# EAGLE design HTVC_connector_board (EAGLE 7.4.0)
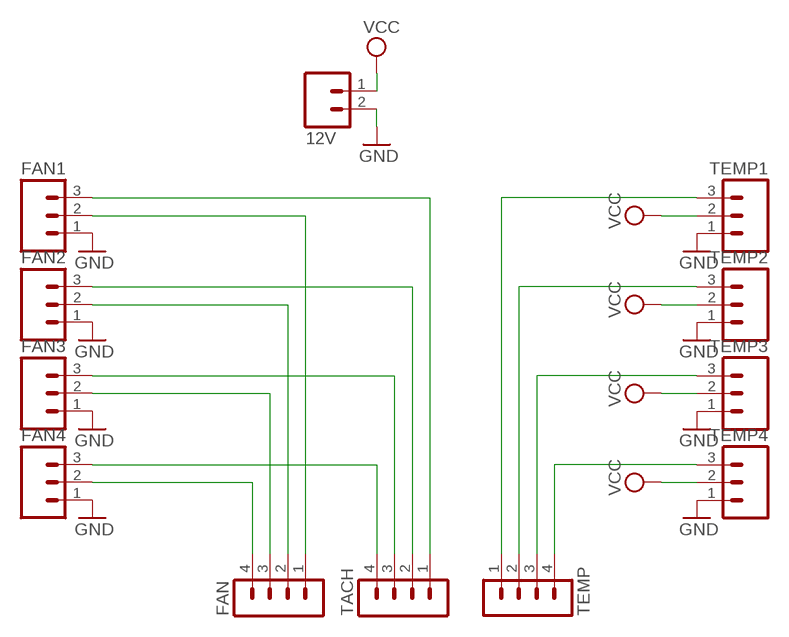
[diagram p0: schematic, sheet 1]

## Parts
12V  M02PTH  [1X02]
FAN  MA04-1  [MA04-1]
FAN1  M03POLAR  [MOLEX-1X3]
FAN2  M03POLAR  [MOLEX-1X3]
FAN3  M03POLAR  [MOLEX-1X3]
FAN4  M03POLAR  [MOLEX-1X3]
TACH  MA04-1  [MA04-1]
TEMP  MA04-1  [MA04-1]
TEMP1  M03POLAR  [MOLEX-1X3]
TEMP2  M03POLAR  [MOLEX-1X3]
TEMP3  M03POLAR  [MOLEX-1X3]
TEMP4  M03POLAR  [MOLEX-1X3]

## Nets
GND: 12V.2 FAN1.1 FAN2.1 FAN3.1 FAN4.1 TEMP1.1 TEMP2.1 TEMP3.1 TEMP4.1
N$1: FAN1.3 TACH.1
N$2: FAN2.3 TACH.2
N$3: FAN3.3 TACH.3
N$4: FAN4.3 TACH.4
N$5: FAN1.2 FAN.1
N$6: FAN2.2 FAN.2
N$7: FAN3.2 FAN.3
N$8: FAN4.2 FAN.4
N$9: TEMP1.3 TEMP.1
N$10: TEMP2.3 TEMP.2
N$11: TEMP3.3 TEMP.3
N$12: TEMP4.3 TEMP.4
VCC: 12V.1 TEMP1.2 TEMP2.2 TEMP3.2 TEMP4.2

## Library data of the parts
12V = SparkFun-Connectors:M02: Standard 2-pin 0.1" header. Use with - straight break away headers ( PRT-00116) - right angle break away headers (PRT-00553) - swiss pins (PRT-00743) - machine pins (PRT-00117) - female headers (PRT-00115) Molex polarized connector foot print use with: PRT-08233 with associated crimp pins and housings. 2.54_SCREWTERM for use with PRT-10571. 3.5mm Screw Terminal footprints for PRT-08084 5mm Screw Terminal footprints for use with PRT-08432
FAN TACH TEMP = con-lstb:MA04-1: PIN HEADER; OC_FARNELL: unknown; OC_NEWARK: unknown
FAN1-FAN4 TEMP1-TEMP4 = SparkFun-Connectors:M03: Header 3 Standard 3-pin 0.1" header. Use with straight break away headers (SKU : PRT-00116), right angle break away headers (PRT-00553), swiss pins (PRT-00743), machine pins (PRT-00117), and female headers (PRT-00115). Molex polarized connector foot print use with SKU : PRT-08232 with associated crimp pins and housings.

## Board
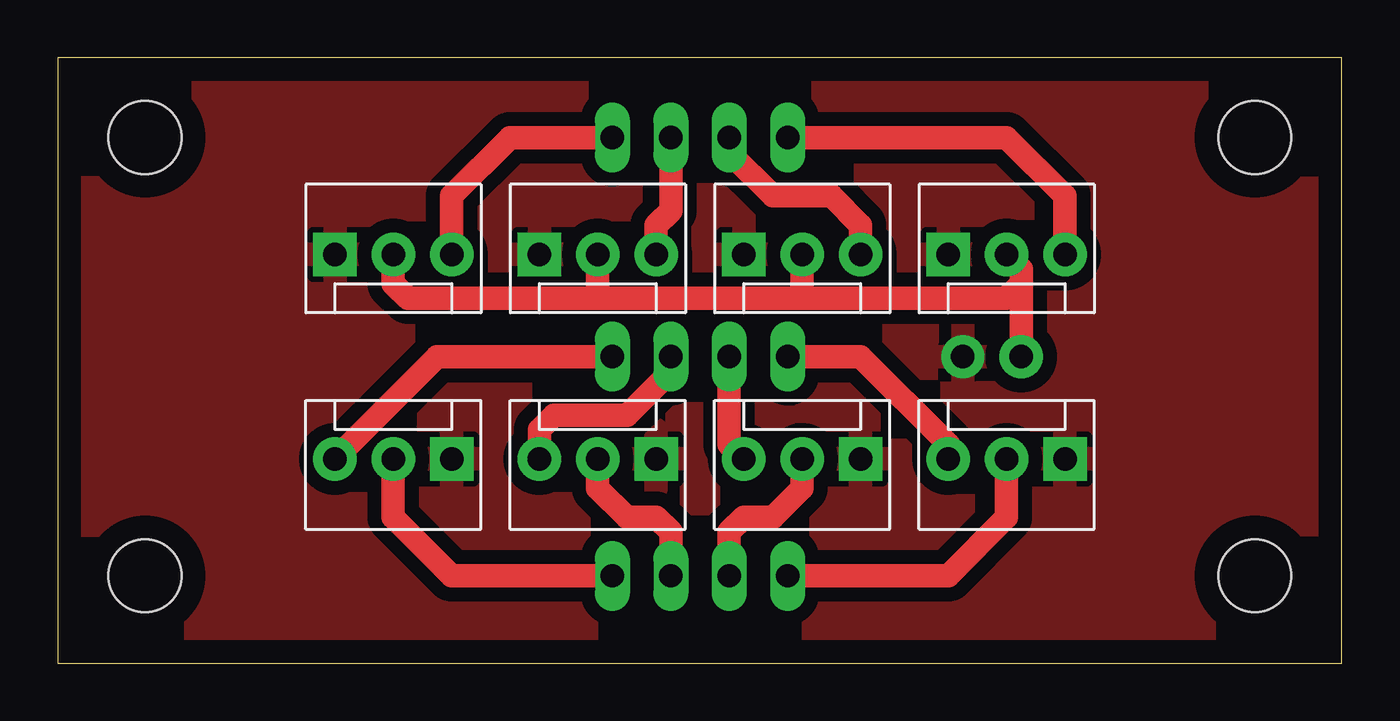
[diagram p1: board, top side]
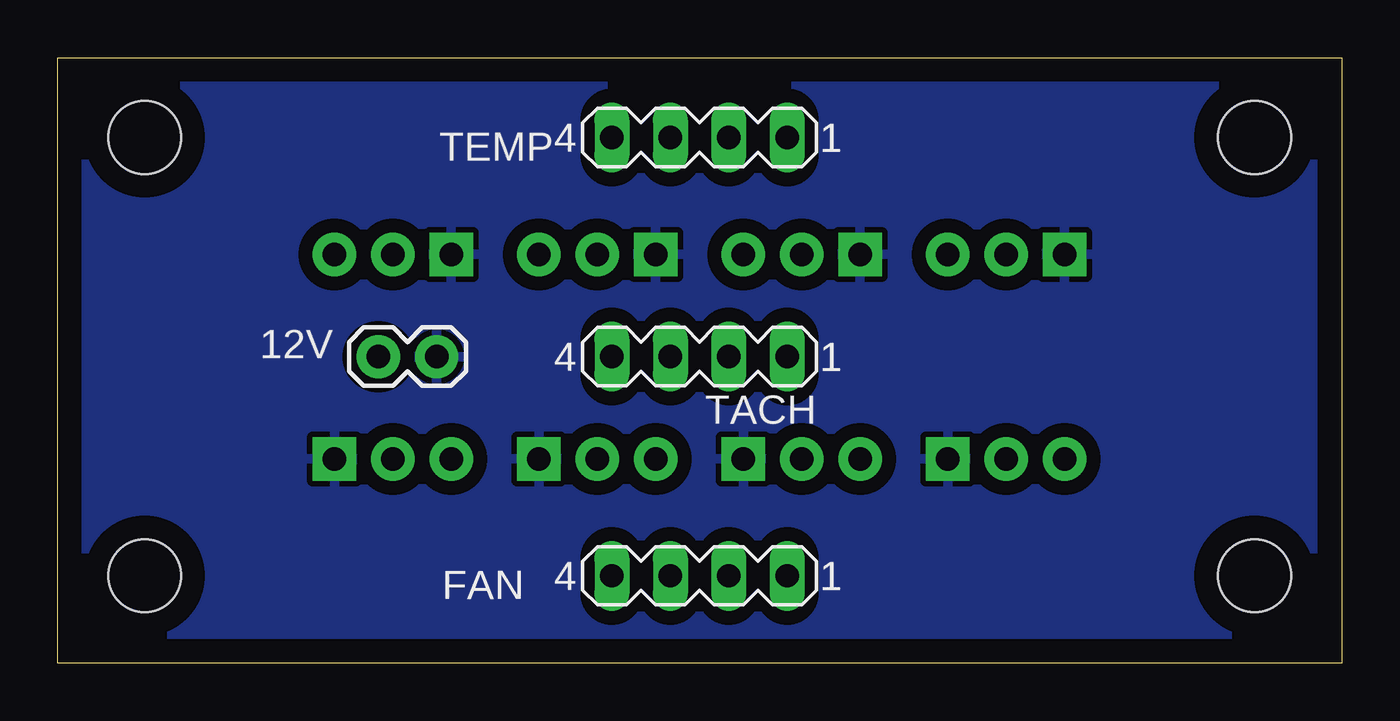
[diagram p2: board, bottom side, seen from below]

Size 55.86 x 26.34 mm. Coordinates in mm from the lower left corner, seen from the top.
Outline: 0,0 55.86,0 55.86,26.34 0,26.34 0,0
Copper layers (1*16): Top 0.035mm / dielectric 1.5mm / Bottom 0.035mm
Design rules "default": minimum track width 10mil, minimum drill 24mil, track to track 8mil, track to pad 8mil, pad to pad 8mil, via to via 8mil, smd to smd 8mil, copper to edge 40mil, drill to drill 8mil, minimum pad ring 10mil, minimum via ring 8mil, stop-mask expansion 4mil, vias tented up to drill 0mil, thermal gap 10mil
Holes 3.17 mm at 3.81,22.86 3.81,3.81 52.07,22.86 52.07,3.81

### Footprints (pad centres in the part's own frame; a part is rotated, then mirrored left to right if it is on the bottom)
1X02 = drill 1.016 pad 1.88: 1 0,0; 2 2.54,0
MA04-1 = drill 1.016 long: 1 -3.81,0; 2 -1.27,0; 3 1.27,0; 4 3.81,0
MOLEX-1X3 = drill 1.016 pad 1.88 square: 1 0,0 | drill 1.016 pad 1.88: 2 2.54,0; 3 5.08,0

### Placement (x,y rotation side)
12V  41.91,13.34 0 bottom
FAN  27.94,3.81 180 bottom
FAN1  17.14,8.89 180 top
FAN2  26.04,8.89 180 top
FAN3  34.92,8.89 180 top
FAN4  43.81,8.89 180 top
TACH  27.94,13.34 180 bottom
TEMP  27.94,22.86 180 bottom
TEMP1  12.06,17.78 0 top
TEMP2  20.95,17.78 0 top
TEMP3  29.84,17.78 0 top
TEMP4  38.73,17.78 0 top

### Tracks (layer width: path | path; a pad name or v marks a point on that pad's centre or on a via)
GND
  pour Bottom (isolate 0.61): 1.27,25.4 54.61,25.4 54.61,1.27 1.27,1.27
  pour Top (isolate 0.61): 0,26.67 55.88,26.67 55.88,0 0,0
N$1
  Top 1.016: FAN1.3 16.51,13.34 TACH.1
N$2
  Top 1.016: TACH.2 26.67,12.7 24.77,10.79 21.59,10.79 20.95,10.16 FAN2.3
N$3
  Top 1.016: TACH.3 29.21,9.53 FAN3.3
N$4
  Top 1.016: FAN4.3 38.73,9.53 34.92,13.34 TACH.4
N$5
  Top 1.016: FAN1.2 14.61,6.35 17.14,3.81 FAN.1
N$6
  Top 1.016: FAN2.2 23.5,7.62 24.77,6.35 26.04,6.35 26.67,5.71 FAN.2
N$7
  Top 1.016: FAN3.2 32.38,7.62 31.11,6.35 29.84,6.35 29.21,5.71 FAN.3
N$8
  Top 1.016: FAN4.2 41.27,6.35 38.73,3.81 FAN.4
N$9
  Top 1.016: TEMP.1 19.68,22.86 17.14,20.32 TEMP1.3
N$10
  Top 1.016: TEMP.2 26.67,19.68 26.04,19.05 TEMP2.3
N$11
  Top 1.016: TEMP.3 29.21,22.23 31.11,20.32 33.66,20.32 34.92,19.05 TEMP3.3
N$12
  Top 1.016: TEMP.4 41.27,22.86 43.81,20.32 TEMP4.3
VCC
  Top 1.016: 12V.1 41.91,16.51 | 41.91,16.51 41.91,17.14 TEMP4.2 | TEMP1.2 14.61,16.51 15.24,15.88 23.5,15.88 | 23.5,15.88 32.38,15.88 | 32.38,15.88 41.27,15.88 41.91,16.51 | TEMP2.2 23.5,15.88 | TEMP3.2 32.38,15.88